# Altium schematic sheet 测试样板原理图.SchDoc
size A3
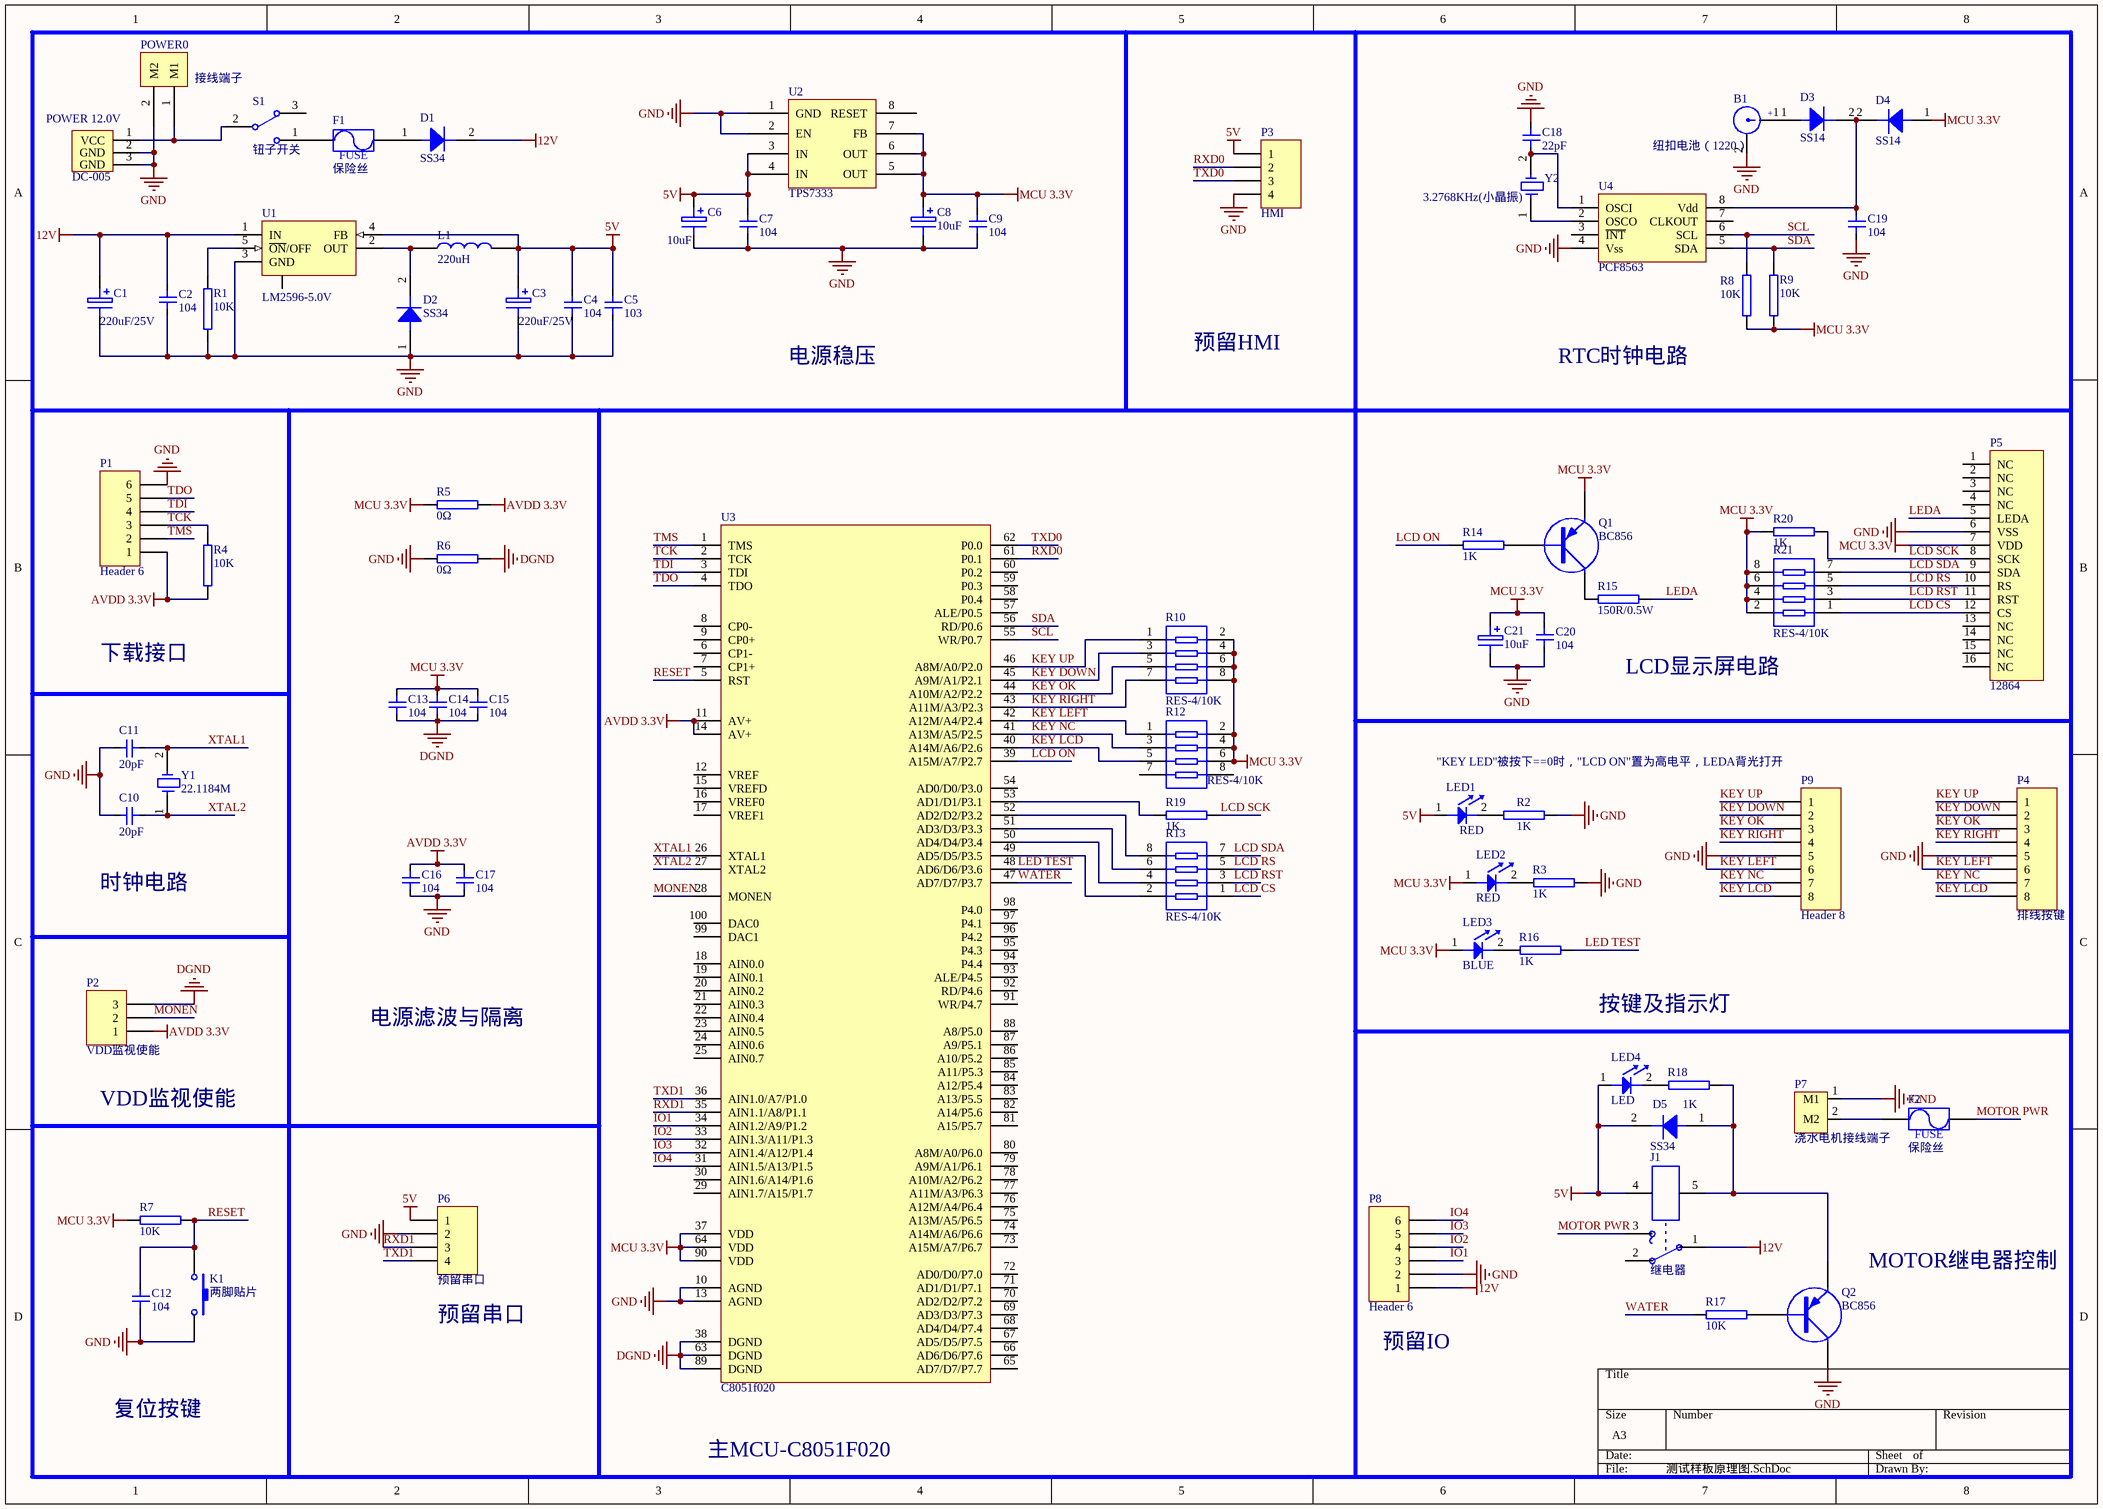
[diagram p0: 测试样板原理图.SchDoc]

## Parts
B1  纽扣电池（1220）  [CR1220]
C1  220uF/25V  [Cap1(100uF)]
C2  104  [0805C]
C3  220uF/25V  [Cap1(100uF)]
C4  104  [0805C]
C5  103  [0805C]
C6  10uF  [Cap122uF)]
C7  104  [0805C]
C8  10uF  [Cap122uF)]
C9  104  [0805C]
C10  20pF  [0805C]
C11  20pF  [0805C]
C12  104  [0805C]
C13  104  [0805C]
C14  104  [0805C]
C15  104  [0805C]
C16  104  [0805C]
C17  104  [0805C]
C18  22pF  [0805C]
C19  104  [0805C]
C20  104  [0805C]
C21  10uF  [Cap122uF)]
D1  SS34  [SS14]
D2  SS34  [SS14]
D3  SS14  [SS14]
D4  SS14  [SS14]
D5  SS34  [SS14]
F1  保险丝  [1812]
F2  保险丝  [1812]
J1  继电器  [继电器]
K1  两脚贴片  [贴片按键]
L1  220uH  [电感 220uh]
LED1  RED  [0805LED]
LED2  RED  [0805LED]
LED3  BLUE  [0805LED]
LED4  LED  [0805LED]
P1  Header 6  [HDR1X6]
P2  VDD监视使能  [HDR1X3]
P3  HMI  [HDR1X4]
P4  排线按键  [Key-8]
P5  12864  [12864]
P6  预留串口  [HDR1X4]
P7  浇水电机接线端子  [接线端子]
P8  Header 6  [HDR1X6]
P9  Header 8  [HDR1X8]
POWER0  接线端子  [接线端子(小)-2PIN]
POWER_12.0V  DC-005  [DC-005]
Q1  BC856  [SOT-23]
Q2  BC856  [SOT-23]
R1  10K  [0805R]
R2  1K  [0805R]
R3  1K  [0805R]
R4  10K  [0805R]
R5  0Ω  [0805R]
R6  0Ω  [0805R]
R7  10K  [0805R]
R8  10K  [0805R]
R9  10K  [0805R]
R10  RES-4/10K  [排阻(4位贴片)]
R12  RES-4/10K  [排阻(4位贴片)]
R13  RES-4/10K  [排阻(4位贴片)]
R14  1K  [0805R]
R15  150R/0.5W  [1210R]
R16  1K  [0805R]
R17  10K  [0805R]
R18  1K  [0805R]
R19  1K  [0805R]
R20  1K  [0805R]
R21  RES-4/10K  [排阻(4位贴片)]
S1  钮子开关  [钮子开关(大)]
U1  LM2596-5.0V  [TO-263-5]
U2  TPS7333  [SO-8]
U3  C8051f020  [LQFP100]
U4  PCF8563  [PCF8563]
Y1  22.1184M  [22M(晶振)]
Y2  3.2768KHz(小晶振)  [XTAL]

## Nets
5V: C3.1 C4.2 C5.2 C6.1 C7.2 D5.2 J1.4 L1.2 LED1.1 LED4.1 P3.1 P6.1 U1.4(FB) U2.3(IN) U2.4(IN)
12V: C1.1 C2.2 D1.2 J1.1 P8.1 U1.1(IN)
AVDD 3.3V: C16.2 C17.2 P1.1 P2.1 R4.1 R5.2 U3.11(AV+) U3.14(AV+)
DGND: C13.1 C14.1 C15.1 P2.3 R6.2 U3.38(DGND) U3.63(DGND) U3.89(DGND)
GND: B1.2 C1.2 C2.1 C3.2 C4.1 C5.1 C6.2 C7.1 C8.2 C9.1 C10.1 C11.1 C12.1 C16.1 C17.1 C18.2 C19.1 C20.1 C21.2 D2.1 K1.2 P1.6 P3.4 P4.5 P5.6(VSS) P6.2 P7.1(M1) P8.2 P9.5 POWER0.2(M2) POWER_12.0V.2(GND) POWER_12.0V.3(GND) Q2.3(C) R1.1 R2.2 R3.2 R6.1 U1.3(GND) U2.1(GND) U2.2(EN) U3.10(AGND) U3.13(AGND) U4.4(Vss)
MCU 3.3V: C8.1 C9.2 C13.2 C14.2 C15.2 C20.2 C21.1 D4.1 LED2.1 LED3.1 P5.7(VDD) Q1.2(E) R5.1 R7.1 R8.1 R9.1 R10.2 R10.4 R10.6 R10.8 R12.2 R12.4 R12.6 R20.1 R21.2 R21.4 R21.6 R21.8 U2.5(OUT) U2.6(OUT) U2.7(FB) U3.37(VDD) U3.64(VDD) U3.90(VDD)
IO1: P8.3 U3.34(AIN1.2/A9/P1.2)
IO2: P8.4 U3.33(AIN1.3/A11/P1.3)
IO3: P8.5 U3.32(AIN1.4/A12/P1.4)
IO4: P8.6 U3.31(AIN1.5/A13/P1.5)
KEY DOWN: P4.2 P9.2 R10.3 U3.45(A9M/A1/P2.1)
KEY LCD: P4.8 P9.8 R12.5 U3.40(A14M/A6/P2.6)
KEY LEFT: P4.6 P9.6 R12.1 U3.42(A12M/A4/P2.4)
KEY NC: P4.7 P9.7 R12.3 U3.41(A13M/A5/P2.5)
KEY OK: P4.3 P9.3 R10.5 U3.44(A10M/A2/P2.2)
KEY RIGHT: P4.4 P9.4 R10.7 U3.43(A11M/A3/P2.3)
KEY UP: P4.1 P9.1 R10.1 U3.46(A8M/A0/P2.0)
LCD CS: P5.12(CS) R13.1 R21.1
LCD ON: R14.2 U3.39(A15M/A7/P2.7)
LCD RS: P5.10(RS) R13.5 R21.5
LCD RST: P5.11(RST) R13.3 R21.3
LCD SCK: P5.8(SCK) R19.2 R20.2
LCD SDA: P5.9(SDA) R13.7 R21.7
LED TEST: R16.2 U3.48(AD6/D6/P3.6)
LEDA: P5.5(LEDA) R15.2
MONEN: P2.2 U3.28(MONEN)
MOTOR PWR: F2.2 J1.3
RESET: C12.2 K1.1 R7.2 U3.5(RST)
RXD0: P3.2 U3.61(P0.1)
RXD1: P6.3 U3.35(AIN1.1/A8/P1.1)
SCL: R8.2 U3.55(WR/P0.7) U4.6(SCL)
SDA: R9.2 U3.56(RD/P0.6) U4.5(SDA)
TCK: P1.3 R4.2 U3.2(TCK)
TDI: P1.4 U3.3(TDI)
TDO: P1.5 U3.4(TDO)
TMS: P1.2 U3.1(TMS)
TXD0: P3.3 U3.62(P0.0)
TXD1: P6.4 U3.36(AIN1.0/A7/P1.0)
WATER: R17.1 U3.47(AD7/D7/P3.7)
XTAL1: C11.2 U3.26(XTAL1) Y1.2
XTAL2: C10.2 U3.27(XTAL2) Y1.1
NetB1_1: B1.1(+) D3.1
NetC18_1: C18.1 U4.1(OSCI) Y2.2
NetC19_2: C19.2 D3.2 D4.2 U4.8(Vdd)
NetD1_1: D1.1 F1.2
NetD2_2: D2.2 L1.1 U1.2(OUT)
NetD5_1: D5.1 J1.5 Q2.2(E) R18.2
NetF1_1: F1.1 S1.1
NetF2_1: F2.1 P7.2(M2)
NetLED1_2: LED1.2 R2.1
NetLED2_2: LED2.2 R3.1
NetLED3_2: LED3.2 R16.1
NetLED4_2: LED4.2 R18.1
NetPOWER0_1: POWER0.1(M1) POWER_12.0V.1(VCC) S1.2
NetQ1_1: Q1.1(B) R14.1
NetQ1_3: Q1.3(C) R15.1
NetQ2_1: Q2.1(B) R17.2
NetR1_2: R1.2 U1.5(~{ON}/OFF)
NetR13_2: R13.2 U3.49(AD5/D5/P3.5)
NetR13_4: R13.4 U3.50(AD4/D4/P3.4)
NetR13_6: R13.6 U3.51(AD3/D3/P3.3)
NetR13_8: R13.8 U3.52(AD2/D2/P3.2)
NetR19_1: R19.1 U3.53(AD1/D1/P3.1)
NetU4_2: U4.2(OSCO) Y2.1

Not connected (* = marked no-connect by the designer): J1 2; P5 1(NC) 2(NC) 3(NC) 4(NC) 13(NC) 14(NC) 15(NC) 16(NC); R12 7 8; S1 3; U1 6; U2 8(RESET); U3 6(CP1-) 7(CP1+) 8(CP0-) 9(CP0+) 12(VREF) 15(VREFD) 16(VREF0) 17(VREF1) 18(AIN0.0) 19(AIN0.1) 20(AIN0.2) 21(AIN0.3) 22(AIN0.4) 23(AIN0.5) 24(AIN0.6) 25(AIN0.7) 29(AIN1.7/A15/P1.7) 30(AIN1.6/A14/P1.6) 54(AD0/D0/P3.0) 57(ALE/P0.5) 58(P0.4) 59(P0.3) 60(P0.2) 65(AD7/D7/P7.7) 66(AD6/D6/P7.6) 67(AD5/D5/P7.5) 68(AD4/D4/P7.4) 69(AD3/D3/P7.3) 70(AD2/D2/P7.2) 71(AD1/D1/P7.1) 72(AD0/D0/P7.0) 73(A15M/A7/P6.7) 74(A14M/A6/P6.6) 75(A13M/A5/P6.5) 76(A12M/A4/P6.4) 77(A11M/A3/P6.3) 78(A10M/A2/P6.2) 79(A9M/A1/P6.1) 80(A8M/A0/P6.0) 81(A15/P5.7) 82(A14/P5.6) 83(A13/P5.5) 84(A12/P5.4) 85(A11/P5.3) 86(A10/P5.2) 87(A9/P5.1) 88(A8/P5.0) 91(WR/P4.7) 92(RD/P4.6) 93(ALE/P4.5) 94(P4.4) 95(P4.3) 96(P4.2) 97(P4.1) 98(P4.0) 99(DAC1) 100(DAC0); U4 3(~{INT}) 7(CLKOUT)

## Notes on the sheet
- 电源稳压
- 预留HMI
- RTC时钟电路
- 下载接口
- LCD显示屏电路
- "KEY LED"被按下==0时，"LCD ON"置为高电平，LEDA背光打开
- 时钟电路
- 电源滤波与隔离
- 按键及指示灯
- VDD监视使能
- (near P6) 预留串口
- (near Q2) MOTOR继电器控制
- (near P8) 预留IO
- 复位按键
- 主MCU-C8051F020
- (in symbol F1) FUSE

## Library data of the parts
C1 C3 C6 C8 C21 = Cap1(100uF)
C2 C4 C5 C7 C9-C20 = C1
D1 D2 D5 = SS14
F1 F2 = F1
K1 = Key(两脚贴片)
L1 = L1
LED1-LED3 = LED
P1 P8 = Header 6: Header, 6-Pin; LatestRevisionDate: 17-Jul-2002; LatestRevisionNote: Re-released for DXP Platform.; Publisher: Altium Limited
P2 = Header 3: Header, 3-Pin; LatestRevisionDate: 17-Jul-2002; LatestRevisionNote: Re-released for DXP Platform.; Publisher: Altium Limited
P3 P6 = Header 4: Header, 4-Pin; LatestRevisionDate: 17-Jul-2002; LatestRevisionNote: Re-released for DXP Platform.; Publisher: Altium Limited
P4 = Key-8
P7 = 接线端子
P9 = Header 8: Header, 8-Pin; LatestRevisionDate: 17-Jul-2002; LatestRevisionNote: Re-released for DXP Platform.; Publisher: Altium Limited
POWER0 = 接线端子(小)-2PIN
Q1 Q2 = Q1
R1-R9 R14-R20 = R1
R10 R12 R13 R21 = RES-4
U1 = LM2596
Y1 Y2 = XTAL